# EAGLE design EIB32-JAE-HPC-v2 (EAGLE 9.5.2)
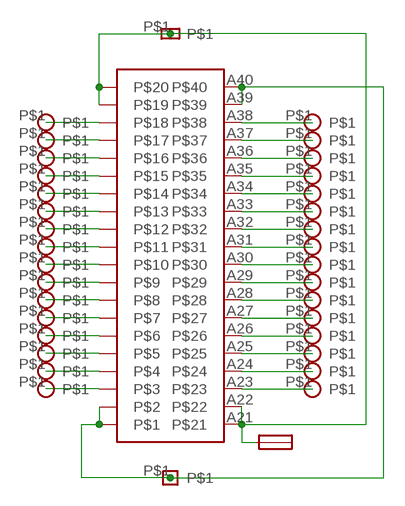
[diagram p0: schematic, sheet 1]

## Parts
U$1  WR-40SB-VFH30  [WR-40SB-VFH30]
U$2  EIB-GND-HOLE-PAD-SMALL  [EIB-GND-HOLE-PAD-SMALL]
U$3  EIB-GND-HOLE-PAD  [EIB-GND-HOLE-PAD]
U$4  JMP-PAD-SMALL  [JMP-PAD-SMALL]
U$5  EIB-TETRODE-HOLE-RS-PAD  [EIB-TETRODE-HOLE-RS-PAD]
U$6  EIB-TETRODE-HOLE-RS-PAD  [EIB-TETRODE-HOLE-RS-PAD]
U$7  EIB-TETRODE-HOLE-RS-PAD  [EIB-TETRODE-HOLE-RS-PAD]
U$8  EIB-TETRODE-HOLE-RS-PAD  [EIB-TETRODE-HOLE-RS-PAD]
U$9  EIB-TETRODE-HOLE-RS-PAD  [EIB-TETRODE-HOLE-RS-PAD]
U$10  EIB-TETRODE-HOLE-RS-PAD  [EIB-TETRODE-HOLE-RS-PAD]
U$11  EIB-TETRODE-HOLE-RS-PAD  [EIB-TETRODE-HOLE-RS-PAD]
U$12  EIB-TETRODE-HOLE-RS-PAD  [EIB-TETRODE-HOLE-RS-PAD]
U$13  EIB-TETRODE-HOLE-RS-PAD  [EIB-TETRODE-HOLE-RS-PAD]
U$14  EIB-TETRODE-HOLE-RS-PAD  [EIB-TETRODE-HOLE-RS-PAD]
U$15  EIB-TETRODE-HOLE-RS-PAD  [EIB-TETRODE-HOLE-RS-PAD]
U$16  EIB-TETRODE-HOLE-RS-PAD  [EIB-TETRODE-HOLE-RS-PAD]
U$17  EIB-TETRODE-HOLE-RS-PAD  [EIB-TETRODE-HOLE-RS-PAD]
U$18  EIB-TETRODE-HOLE-RS-PAD  [EIB-TETRODE-HOLE-RS-PAD]
U$19  EIB-TETRODE-HOLE-RS-PAD  [EIB-TETRODE-HOLE-RS-PAD]
U$20  EIB-TETRODE-HOLE-RS-PAD  [EIB-TETRODE-HOLE-RS-PAD]
U$23  EIB-TETRODE-HOLE-RS-PAD  [EIB-TETRODE-HOLE-RS-PAD]
U$24  EIB-TETRODE-HOLE-RS-PAD  [EIB-TETRODE-HOLE-RS-PAD]
U$25  EIB-TETRODE-HOLE-RS-PAD  [EIB-TETRODE-HOLE-RS-PAD]
U$26  EIB-TETRODE-HOLE-RS-PAD  [EIB-TETRODE-HOLE-RS-PAD]
U$27  EIB-TETRODE-HOLE-RS-PAD  [EIB-TETRODE-HOLE-RS-PAD]
U$28  EIB-TETRODE-HOLE-RS-PAD  [EIB-TETRODE-HOLE-RS-PAD]
U$29  EIB-TETRODE-HOLE-RS-PAD  [EIB-TETRODE-HOLE-RS-PAD]
U$30  EIB-TETRODE-HOLE-RS-PAD  [EIB-TETRODE-HOLE-RS-PAD]
U$31  EIB-TETRODE-HOLE-RS-PAD  [EIB-TETRODE-HOLE-RS-PAD]
U$32  EIB-TETRODE-HOLE-RS-PAD  [EIB-TETRODE-HOLE-RS-PAD]
U$33  EIB-TETRODE-HOLE-RS-PAD  [EIB-TETRODE-HOLE-RS-PAD]
U$34  EIB-TETRODE-HOLE-RS-PAD  [EIB-TETRODE-HOLE-RS-PAD]
U$35  EIB-TETRODE-HOLE-RS-PAD  [EIB-TETRODE-HOLE-RS-PAD]
U$36  EIB-TETRODE-HOLE-RS-PAD  [EIB-TETRODE-HOLE-RS-PAD]
U$37  EIB-TETRODE-HOLE-RS-PAD  [EIB-TETRODE-HOLE-RS-PAD]
U$38  EIB-TETRODE-HOLE-RS-PAD  [EIB-TETRODE-HOLE-RS-PAD]

## Nets
N$1: U$1.A19 U$1.A20 U$1.A21 U$1.A22 U$2.P$1 U$4.P$1
N$3: U$1.A1 U$1.A2 U$1.A39 U$1.A40 U$3.P$1
N$6: U$1.A18 U$5.P$1
N$7: U$1.A17 U$6.P$1
N$8: U$1.A16 U$7.P$1
N$9: U$1.A15 U$8.P$1
N$10: U$1.A14 U$9.P$1
N$11: U$1.A13 U$10.P$1
N$12: U$1.A12 U$11.P$1
N$13: U$1.A11 U$12.P$1
N$14: U$1.A10 U$13.P$1
N$15: U$1.A9 U$14.P$1
N$16: U$1.A8 U$15.P$1
N$17: U$1.A7 U$16.P$1
N$18: U$1.A6 U$17.P$1
N$19: U$1.A5 U$18.P$1
N$20: U$1.A4 U$19.P$1
N$21: U$1.A3 U$20.P$1
N$24: U$1.A38 U$23.P$1
N$25: U$1.A37 U$24.P$1
N$26: U$1.A36 U$25.P$1
N$27: U$1.A35 U$26.P$1
N$28: U$1.A34 U$27.P$1
N$29: U$1.A33 U$28.P$1
N$30: U$1.A32 U$29.P$1
N$31: U$1.A31 U$30.P$1
N$32: U$1.A30 U$31.P$1
N$33: U$1.A29 U$32.P$1
N$34: U$1.A28 U$33.P$1
N$35: U$1.A27 U$34.P$1
N$36: U$1.A26 U$35.P$1
N$37: U$1.A25 U$36.P$1
N$38: U$1.A24 U$37.P$1
N$39: U$1.A23 U$38.P$1

## Library data of the parts
U$1 = EIBLibrary:WR-40SB-VFH30
U$2 = EIBLibrary:EIB-GND-HOLE-PAD-SMALL
U$3 = EIBLibrary:EIB-GND-HOLE-PAD
U$4 = EIBLibrary:JMP-PAD-SMALL
U$5-U$20 U$23-U$38 = EIBLibrary:EIB-TETRODE-HOLE-RS-PAD

## Board
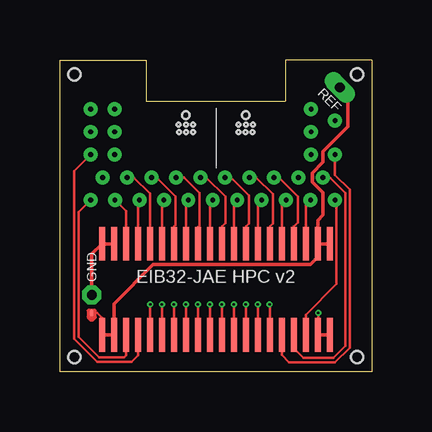
[diagram p1: board, top side]
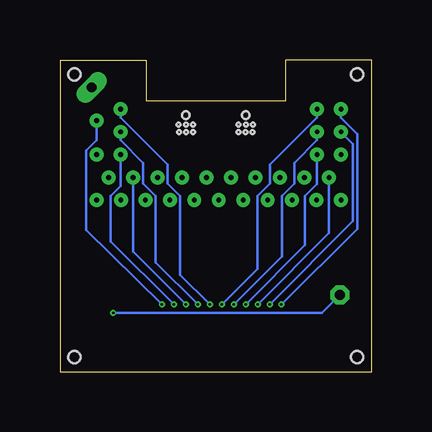
[diagram p2: board, bottom side, seen from below]

Size 13 x 13 mm. Coordinates in mm from the lower left corner, seen from the top.
Outline: 0,0 0,13 3.6,13 3.6,11.28 9.4,11.28 9.4,13 13,13 13,0 0,0
Copper layers (1*16): Top 0.012mm / dielectric 1.55mm / Bottom 0.012mm
Design rules "Multi-CB_2L_075um-Tracks_OL35um *": minimum track width 0.1mm, minimum drill 0.1mm, track to track 0.085mm, track to pad 0.085mm, pad to pad 0.085mm, via to via 0.085mm, smd to smd 0mil, copper to edge 0.2mm, drill to drill 0.15mm, minimum pad ring 0.125mm, minimum via ring 0.075mm, stop-mask expansion 2mil, vias tented up to drill 0.45mm, thermal gap 0.2mm
Holes 0.5 mm at 12.4,12.4 0.6,0.6 12.4,0.6 0.6,12.4
Holes 0.15 mm at 7.75,10.3 8.05,10.3 7.74,10 7.45,10.3 8.04,10 7.44,10 5.25,10.3 4.95,10.3 5.26,10 5.55,10.3 4.96,10 5.56,10
Holes 0.3 mm at 7.75,10.7 5.25,10.7

### Footprints (pad centres in the part's own frame; a part is rotated, then mirrored left to right if it is on the bottom)
WR-40SB-VFH30 = smd 0.25 x 1.4: A1 0,0; A2 0.5,0; A3 1,0; A4 1.5,0; A5 2,0; A6 2.5,0; A7 3,0; A8 3.5,0; A9 4,0; A10 4.5,0; A11 5,0; A12 5.5,0; A13 6,0; A14 6.5,0; A15 7,0; A16 7.5,0; A17 8,0; A18 8.5,0; A19 9,0; A20 9.5,0; A21 0,-3.8; A22 0.5,-3.8; A23 1,-3.8; A24 1.5,-3.8; A25 2,-3.8; A26 2.5,-3.8; A27 3,-3.8; A28 3.5,-3.8; A29 4,-3.8; A30 4.5,-3.8; A31 5,-3.8; A32 5.5,-3.8; A33 6,-3.8; A34 6.5,-3.8; A35 7,-3.8; A36 7.5,-3.8; A37 8,-3.8; A38 8.5,-3.8; A39 9,-3.8; A40 9.5,-3.8
EIB-GND-HOLE-PAD-SMALL = drill 0.4 pad 0.76 long: P$1 0,0
EIB-GND-HOLE-PAD = drill 0.4 pad 0.8 octagon: P$1 0,0
JMP-PAD-SMALL = smd 0.305 x 0.152: P$1 0.1,0
EIB-TETRODE-HOLE-RS-PAD = drill 0.2 pad 0.58: P$1 0,0

### Placement (x,y rotation side)
U$1  1.75,5.33 0 top
U$2  11.68,11.85 135 top
U$3  1.32,3.2 0 top
U$4  1.32,2.55 270 top
U$5  10.46,7.15 180 top
U$6  8.93,8.1 180 top
U$7  9.44,7.15 180 top
U$8  7.91,8.1 180 top
U$9  8.41,7.15 180 top
U$10  6.89,8.1 90 top
U$11  7.39,7.15 90 top
U$12  5.86,8.1 90 top
U$13  6.38,7.15 90 top
U$14  4.84,8.1 90 top
U$15  5.36,7.15 90 top
U$16  3.82,8.1 180 top
U$17  4.33,7.15 180 top
U$18  2.8,8.1 180 top
U$19  3.31,7.15 180 top
U$20  2.29,7.15 180 top
U$23  11.47,7.15 90 top
U$24  10.97,8.1 90 top
U$25  11.47,9.05 90 top
U$26  11.47,10.47 90 top
U$27  10.47,9.05 270 top
U$28  9.95,8.1 270 top
U$29  10.47,10 270 top
U$30  10.47,10.95 270 top
U$31  2.27,10.95 90 top
U$32  2.27,10 90 top
U$33  2.27,9.05 90 top
U$34  1.77,8.1 180 top
U$35  1.27,10 180 top
U$36  1.27,10.95 180 top
U$37  1.27,9.05 180 top
U$38  1.27,7.15 180 top

### Tracks (layer width: path | path; a pad name or v marks a point on that pad's centre or on a via)
N$1
  Top 0.1: U$1.A20 11.28,5.33 11.27,5.33 | 10.75,4.8 U$1.A19 | U$1.A21 1.75,2.25 1.55,2.45 U$4.P$1
  Top 0.15: 11.27,5.33 U$1.A19 10.75,6.3 10.97,6.53 10.97,7.46 10.53,7.91 10.53,8.29 10.97,8.74 10.97,9.19 12,10.21 12,11.53 U$2.P$1 | U$1.A21 U$1.A22 2.25,2.83 3.9,4.47 10.44,4.47 10.75,4.78 10.75,4.8
N$3  (via drill 0.1)
  Top 0.1: v10.78,2.45 10.78,1.57 U$1.A39
  Top 0.15: U$3.P$1 1.32,4.91 U$1.A1 U$1.A2 | U$1.A39 U$1.A40
  Bottom 0.1: U$3.P$1 2.08,2.45 v10.78,2.45
N$6
  Top 0.1: U$1.A18 10.25,6.95 U$5.P$1
N$7
  Top 0.1: U$6.P$1 9.12,8.1 9.93,7.3 9.93,6.22 9.75,6.05 U$1.A17
N$8
  Top 0.1: U$1.A16 9.25,6.96 U$7.P$1
N$9
  Top 0.1: U$8.P$1 8.18,8.1 8.88,7.4 8.88,6.17 8.75,6.05 U$1.A15
N$10
  Top 0.1: U$1.A14 8.25,6.99 U$9.P$1
N$11
  Top 0.1: U$10.P$1 7.12,8.1 7.88,7.35 7.88,6.17 7.75,6.05 U$1.A13
N$12
  Top 0.1: U$1.A12 7.25,7 U$11.P$1
N$13
  Top 0.1: U$12.P$1 6.1,8.1 6.9,7.3 6.9,6.2 6.75,6.05 U$1.A11
N$14
  Top 0.1: U$1.A10 6.25,7.03 U$13.P$1
N$15
  Top 0.1: U$1.A9 5.75,6.03 5.83,6.1 5.83,7.45 5.17,8.1 U$14.P$1
N$16
  Top 0.1: U$1.A8 5.25,7.04 U$15.P$1
N$17
  Top 0.1: U$16.P$1 4.03,8.1 4.83,7.3 4.83,6.12 4.75,6.05 U$1.A7
N$18
  Top 0.1: U$1.A6 4.25,7.07 U$17.P$1
N$19
  Top 0.1: U$1.A5 3.75,7.42 3.08,8.1 U$18.P$1
N$20
  Top 0.1: U$1.A4 3.25,7.08 U$19.P$1
N$21
  Top 0.1: U$1.A3 2.75,6.7 U$20.P$1
N$24
  Top 0.1: U$1.A38 10.25,2.38 11.53,3.65 11.53,7.1 U$23.P$1
N$25
  Top 0.1: U$24.P$1 11.03,8.07 11.28,8.07 11.9,7.45 11.9,1.07 11.4,0.57 10.15,0.57 9.78,0.95 9.78,1.45 U$1.A37
N$26
  Top 0.1: U$25.P$1 11.47,8.2 12.09,7.59 12.09,1 11.48,0.39 9.56,0.39 9.25,0.7 U$1.A36
N$27  (via drill 0.1)
  Top 0.1: v8.74,2.8 v8.75,2.79 U$1.A35
  Bottom 0.1: v8.74,2.8 11.9,5.92 11.9,9.23 11.47,9.65 U$26.P$1
N$28  (via drill 0.1)
  Top 0.1: v8.25,2.8 U$1.A34
  Bottom 0.1: U$27.P$1 10.47,7.73 10.88,7.33 10.88,5.43 v8.25,2.8
N$29  (via drill 0.1)
  Top 0.1: v7.75,2.8 U$1.A33
  Bottom 0.1: v7.75,2.8 9.95,5 U$28.P$1
N$30  (via drill 0.1)
  Top 0.1: v7.25,2.8 U$1.A32
  Bottom 0.1: U$29.P$1 10.47,9.65 9.53,8.7 9.53,7.84 9.01,7.33 9.01,4.56 v7.25,2.8
N$31  (via drill 0.1)
  Top 0.1: v6.75,2.8 U$1.A31
  Bottom 0.1: U$30.P$1 10.47,10.6 8.51,8.63 8.51,7.84 7.99,7.33 7.99,4.04 v6.75,2.8
N$32  (via drill 0.1)
  Top 0.1: v6.25,2.8 U$1.A30
  Bottom 0.1: U$31.P$1 2.27,10.6 4.24,8.63 4.24,7.84 4.76,7.33 4.76,4.29 v6.25,2.8
N$33  (via drill 0.1)
  Top 0.1: v5.75,2.8 U$1.A29
  Bottom 0.1: U$32.P$1 2.27,9.65 3.22,8.7 3.22,7.84 3.74,7.33 3.74,4.81 v5.75,2.8
N$34  (via drill 0.1)
  Top 0.1: v5.25,2.8 U$1.A28
  Bottom 0.1: U$33.P$1 2.27,7.83 2.77,7.33 2.77,5.28 v5.25,2.8
N$35  (via drill 0.1)
  Top 0.1: v4.75,2.8 U$1.A27
  Bottom 0.1: U$34.P$1 1.77,5.78 v4.75,2.8
N$36  (via drill 0.1)
  Top 0.1: v4.25,2.8 U$1.A26
  Bottom 0.1: v4.25,2.8 0.78,6.28 0.78,9.5 U$35.P$1
N$37  (via drill 0.1)
  Top 0.1: U$1.A25 3.75,2.79 v3.77,2.8
  Bottom 0.1: U$36.P$1 1.27,10.6 0.59,9.92 0.59,5.94 v3.77,2.8
N$38
  Top 0.1: U$1.A24 3.25,0.68 2.99,0.41 1.55,0.41 0.59,1.37 0.59,8.37 U$37.P$1
N$39
  Top 0.1: U$1.A23 2.75,0.68 2.67,0.6 1.62,0.6 0.78,1.45 0.78,6.65 U$38.P$1

### Text on the board
tPlace: REF | GND | EIB32-JAE HPC v2